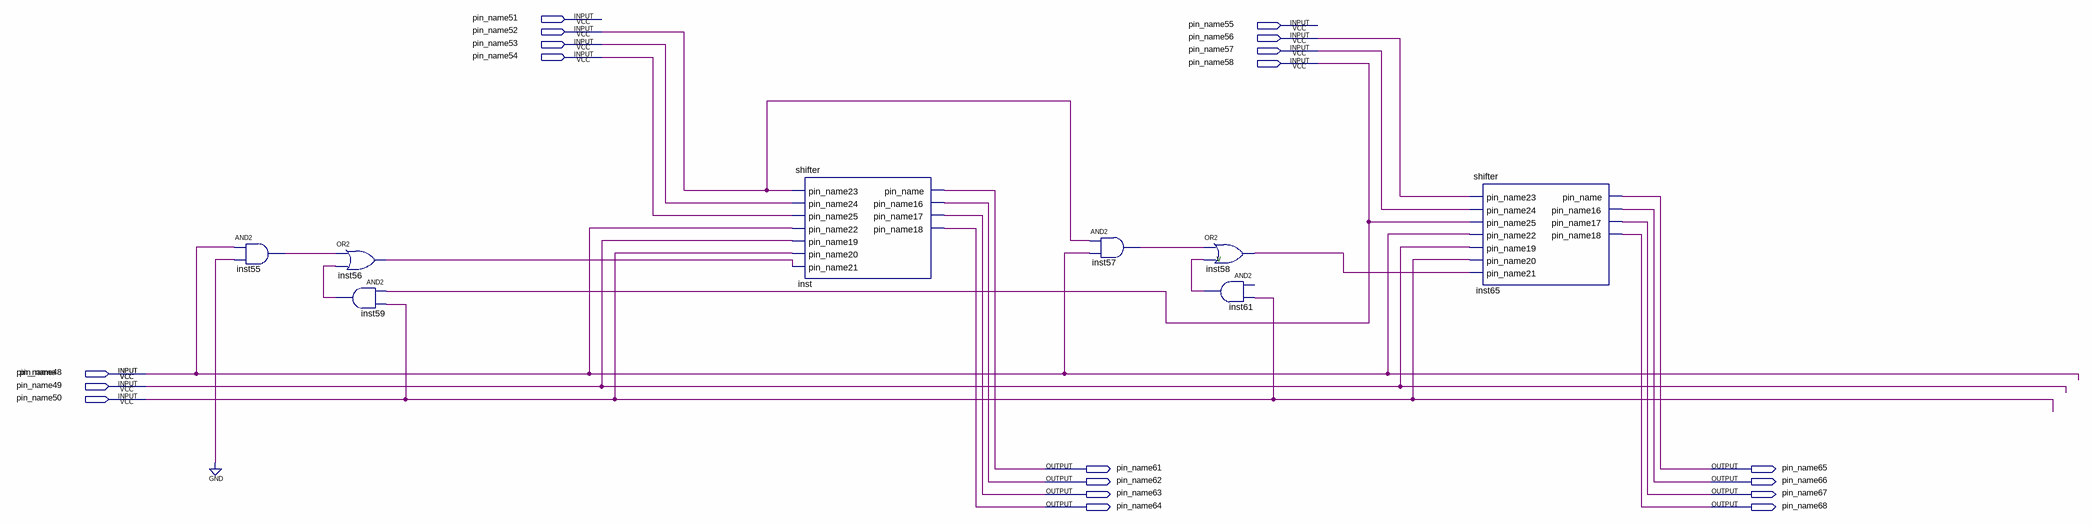
[diagram p0: schematic sheet]
// Quartus schematic shifter-16.bdf as structural Verilog: 8 symbols, 20 pins
module \shifter-16  (
  input  pin_name51,
  input  pin_name55,
  input  pin_name52,
  input  pin_name56,
  input  pin_name53,
  input  pin_name57,
  input  pin_name54,
  input  pin_name58,
  input  pin_name,
  input  pin_name48,
  input  pin_name49,
  input  pin_name50,
  output pin_name61,
  output pin_name65,
  output pin_name62,
  output pin_name66,
  output pin_name63,
  output pin_name67,
  output pin_name64,
  output pin_name68
);

  wire inst55_out, inst56_out, inst57_out, inst58_out, inst59_out, inst61_out;

  and inst55 (inst55_out, pin_name, 1'b0);
  or inst56 (inst56_out, inst55_out, inst59_out);
  and inst59 (inst59_out, pin_name58, pin_name50);
  shifter inst (
    .pin_name23(pin_name52), .pin_name24(pin_name53), .pin_name25(pin_name54), .pin_name22(pin_name),
    .pin_name19(pin_name49), .pin_name20(pin_name50), .pin_name21(inst56_out), .pin_name(pin_name61),
    .pin_name16(pin_name62), .pin_name17(pin_name63), .pin_name18(pin_name64));
  and inst57 (inst57_out, pin_name52, pin_name);
  or inst58 (inst58_out, inst57_out, inst61_out);
  buf inst61 (inst61_out, pin_name50);  // AND2 open: IN1
  shifter inst65 (
    .pin_name23(pin_name56), .pin_name24(pin_name57), .pin_name25(pin_name58), .pin_name22(pin_name),
    .pin_name19(pin_name49), .pin_name20(pin_name50), .pin_name21(inst58_out), .pin_name(pin_name65),
    .pin_name16(pin_name66), .pin_name17(pin_name67), .pin_name18(pin_name68));

  assign pin_name48 = pin_name;

  // Notes on the sheet:
  //   v
endmodule
